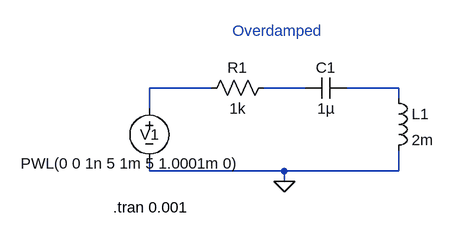
[diagram p0: schematic Overdamped LCR Circuit.asc]
Overdamped LCR Circuit.asc, the LTspice schematic file:
Version 4
SHEET 1 880 680
WIRE 160 112 64 112
WIRE 304 112 240 112
WIRE 448 112 368 112
WIRE 448 128 448 112
WIRE 64 144 64 112
WIRE 64 240 64 224
WIRE 272 240 64 240
WIRE 448 240 448 208
WIRE 448 240 272 240
WIRE 272 256 272 240
FLAG 272 256 0
SYMBOL res 256 96 R90
WINDOW 0 0 56 VBottom 2
WINDOW 3 32 56 VTop 2
SYMATTR InstName R1
SYMATTR Value 1k
SYMBOL cap 368 96 R90
WINDOW 0 0 32 VBottom 2
WINDOW 3 32 32 VTop 2
SYMATTR InstName C1
SYMATTR Value 1µ
SYMBOL ind 432 112 R0
SYMATTR InstName L1
SYMATTR Value 2m
SYMBOL voltage 64 128 R0
WINDOW 0 -14 56 Left 2
WINDOW 3 -198 100 Left 2
WINDOW 123 0 0 Left 0
WINDOW 39 0 0 Left 0
SYMATTR InstName V1
SYMATTR Value PWL(0 0 1n 5 1m 5 1.0001m 0)
TEXT 8 296 Left 2 !.tran 0.001
TEXT 192 24 Left 2 ;Overdamped

The netlist it stands for:
* Overdamped LCR Circuit.asc
R1 N002 N001 1k
C1 N003 N002 1µ
L1 N003 0 2m
V1 N001 0 PWL(0 0 1n 5 1m 5 1.0001m 0)
.tran 0.001
* Overdamped
.backanno
.end